# Altium schematic sheet FMC_HPC_UFL_DEBUG_HPC_CD.SchDoc: HPC connector ROW C and ROW D, Testpoints for I2C and JTAG bus signals
size A4; Date: 13.12.2024; ApprovedBy: PFH; CompanyName: IAM Electronic GmbH; DrawnBy: PFH; Engineer: PFH; DocumentNumber: 6; Revision: A; SheetNumber: 6; SheetTotal: 9; Projekt: FMC HPC-U.FL Debug Board; Website: www.fmchub.com
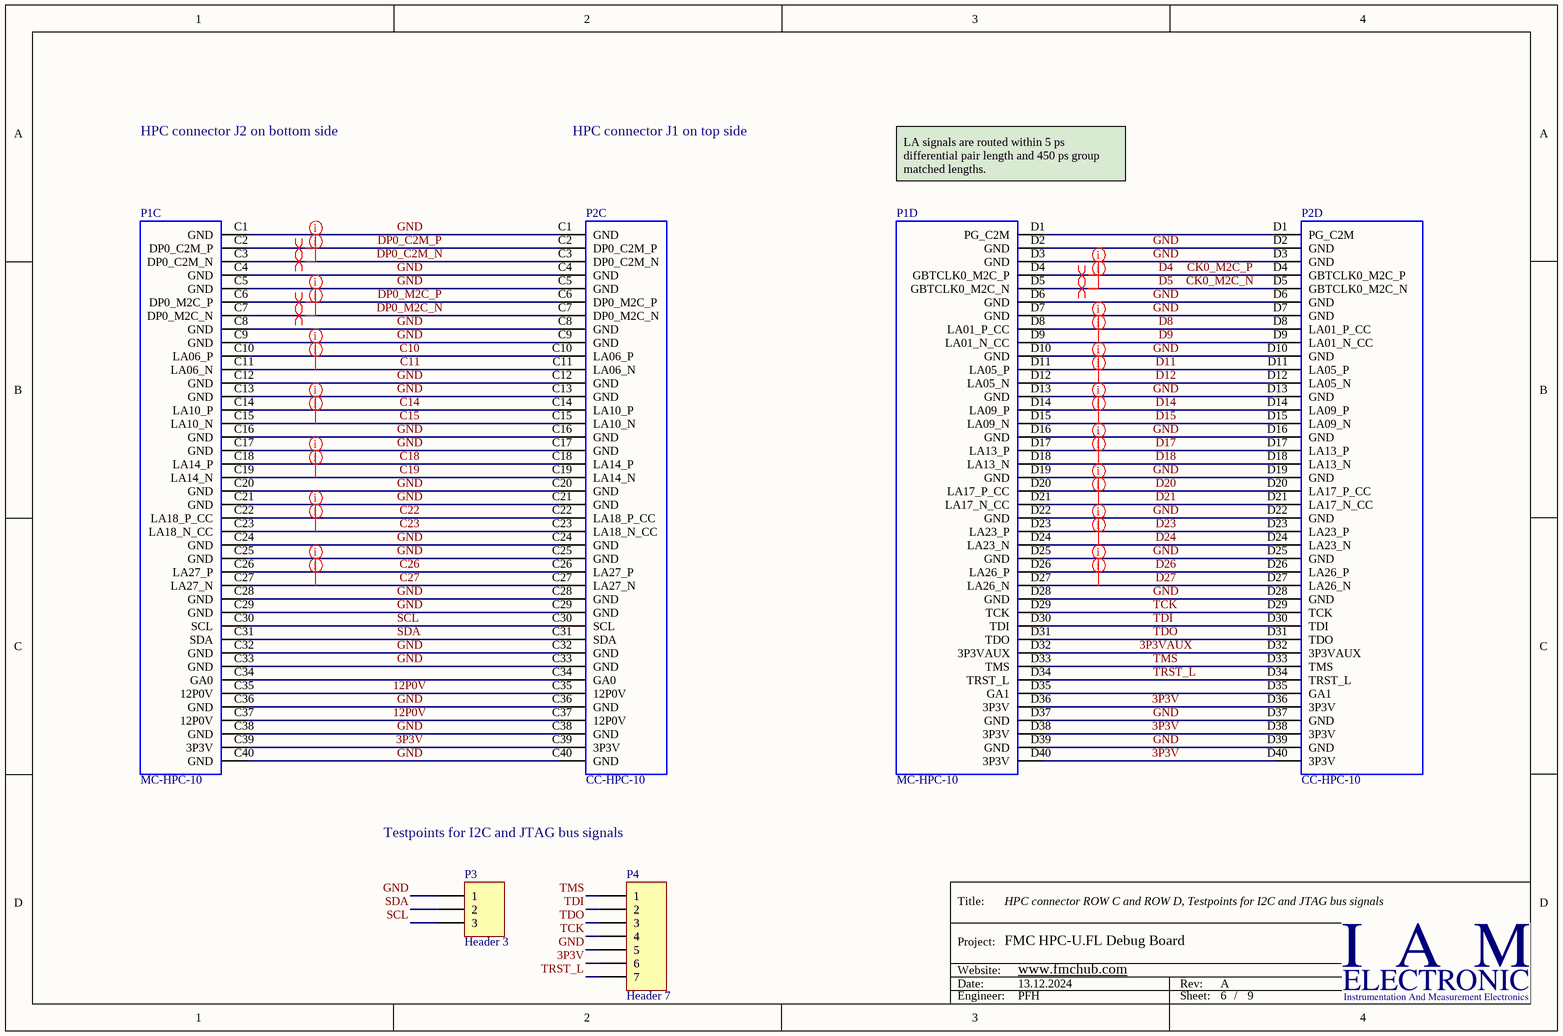
[diagram p0: FMC_HPC_UFL_DEBUG_HPC_CD.SchDoc]

## Parts
P1  MC-HPC-10  [ASP-134488-01]  (parts C,D of 10)
P2  CC-HPC-10  [ASP-134486-01]  (parts C,D of 10)
P3  Header 3  [HDR1X3]  (no BOM)
P4  Header 7  [HDR1X7]  (no BOM)

## Nets
3P3V: P1.C39(3P3V) P1.D36(3P3V) P1.D38(3P3V) P1.D40(3P3V) P2.C39(3P3V) P2.D36(3P3V) P2.D38(3P3V) P2.D40(3P3V) P4.6
3P3VAUX: P1.D32(3P3VAUX) P2.D32(3P3VAUX)
12P0V: P1.C35(12P0V) P1.C37(12P0V) P2.C35(12P0V) P2.C37(12P0V)
C10: P1.C10(LA06_P) P2.C10(LA06_P)
C11: P1.C11(LA06_N) P2.C11(LA06_N)
C14: P1.C14(LA10_P) P2.C14(LA10_P)
C15: P1.C15(LA10_N) P2.C15(LA10_N)
C18: P1.C18(LA14_P) P2.C18(LA14_P)
C19: P1.C19(LA14_N) P2.C19(LA14_N)
C22: P1.C22(LA18_P_CC) P2.C22(LA18_P_CC)
C23: P1.C23(LA18_N_CC) P2.C23(LA18_N_CC)
C26: P1.C26(LA27_P) P2.C26(LA27_P)
C27: P1.C27(LA27_N) P2.C27(LA27_N)
CK0_M2C_N: P1.D5(GBTCLK0_M2C_N) P2.D5(GBTCLK0_M2C_N)  [also labelled D5]
CK0_M2C_P: P1.D4(GBTCLK0_M2C_P) P2.D4(GBTCLK0_M2C_P)  [also labelled D4]
D8: P1.D8(LA01_P_CC) P2.D8(LA01_P_CC)
D9: P1.D9(LA01_N_CC) P2.D9(LA01_N_CC)
D11: P1.D11(LA05_P) P2.D11(LA05_P)
D12: P1.D12(LA05_N) P2.D12(LA05_N)
D14: P1.D14(LA09_P) P2.D14(LA09_P)
D15: P1.D15(LA09_N) P2.D15(LA09_N)
D17: P1.D17(LA13_P) P2.D17(LA13_P)
D18: P1.D18(LA13_N) P2.D18(LA13_N)
D20: P1.D20(LA17_P_CC) P2.D20(LA17_P_CC)
D21: P1.D21(LA17_N_CC) P2.D21(LA17_N_CC)
D23: P1.D23(LA23_P) P2.D23(LA23_P)
D24: P1.D24(LA23_N) P2.D24(LA23_N)
D26: P1.D26(LA26_P) P2.D26(LA26_P)
D27: P1.D27(LA26_N) P2.D27(LA26_N)
DP0_C2M_N: P1.C3(DP0_C2M_N) P2.C3(DP0_C2M_N)
DP0_C2M_P: P1.C2(DP0_C2M_P) P2.C2(DP0_C2M_P)
DP0_M2C_N: P1.C7(DP0_M2C_N) P2.C7(DP0_M2C_N)
DP0_M2C_P: P1.C6(DP0_M2C_P) P2.C6(DP0_M2C_P)
GND: P1.C1(GND) P1.C4(GND) P1.C5(GND) P1.C8(GND) P1.C9(GND) P1.C12(GND) P1.C13(GND) P1.C16(GND) P1.C17(GND) P1.C20(GND) P1.C21(GND) P1.C24(GND) P1.C25(GND) P1.C28(GND) P1.C29(GND) P1.C32(GND) P1.C33(GND) P1.C36(GND) P1.C38(GND) P1.C40(GND) P1.D2(GND) P1.D3(GND) P1.D6(GND) P1.D7(GND) P1.D10(GND) P1.D13(GND) P1.D16(GND) P1.D19(GND) P1.D22(GND) P1.D25(GND) P1.D28(GND) P1.D37(GND) P1.D39(GND) P2.C1(GND) P2.C4(GND) P2.C5(GND) P2.C8(GND) P2.C9(GND) P2.C12(GND) P2.C13(GND) P2.C16(GND) P2.C17(GND) P2.C20(GND) P2.C21(GND) P2.C24(GND) P2.C25(GND) P2.C28(GND) P2.C29(GND) P2.C32(GND) P2.C33(GND) P2.C36(GND) P2.C38(GND) P2.C40(GND) P2.D2(GND) P2.D3(GND) P2.D6(GND) P2.D7(GND) P2.D10(GND) P2.D13(GND) P2.D16(GND) P2.D19(GND) P2.D22(GND) P2.D25(GND) P2.D28(GND) P2.D37(GND) P2.D39(GND) P3.1 P4.5
SCL: P1.C30(SCL) P2.C30(SCL) P3.3
SDA: P1.C31(SDA) P2.C31(SDA) P3.2
TCK: P1.D29(TCK) P2.D29(TCK) P4.4
TDI: P1.D30(TDI) P2.D30(TDI) P4.2
TDO: P1.D31(TDO) P2.D31(TDO) P4.3
TMS: P1.D33(TMS) P2.D33(TMS) P4.1
TRST_L: P1.D34(TRST_L) P2.D34(TRST_L) P4.7
NetP1_C34: P1.C34(GA0) P2.C34(GA0)
NetP1_D1: P1.D1(PG_C2M) P2.D1(PG_C2M)
NetP1_D35: P1.D35(GA1) P2.D35(GA1)

## Layout directives
differential pair: CK0_M2C_N, CK0_M2C_P, DP0_C2M_N, DP0_C2M_P, DP0_M2C_N, DP0_M2C_P
net class MGT; rule Differential Pairs Routing [Pref Gap = 6mil    Min Gap  = 6mil    Max Gap  = 6milPref Width = 6mil    Min Width  = 4mil    Max Width  = 6mil]; rule Matched Net Lengths [Delay Tolerance = 120ps]: CK0_M2C_N, CK0_M2C_P, DP0_C2M_N, DP0_C2M_P, DP0_M2C_N, DP0_M2C_P
rule Width Constraint [Pref Impedance = 50,00ohms    Min Impedance = 50,00ohms    Max Impedance = 50,00ohms]; net class FMC_LA: C10, C11, C14, C15, C18, C19, C22, C23, C26, C27, D8, D9, D11, D12, D14, D15, D17, D18, D20, D21, D23, D24, D26, D27

## Notes on the sheet
- HPC connector J2 on bottom side
- HPC connector J1 on top side
- LA signals are routed within 5 ps differential pair length and 450 ps group matched lengths.
- Testpoints for I2C and JTAG bus signals
- Title:
- Project:
- Date:
- Website:
- Rev:
- Engineer:
- Sheet:
- /

## Library data of the parts
P1 = MC-HPC-10: MC-HPC-10, FMC High-pin count connector, lead free, 400 I/Os, male, 10 mm mated stack height; Manufacturer: Samtec; Manufacturer Ref: SEAM-40-03.5-S-10-2-A-K-TR-VITA57.0; Pitch: 1.27 mm; Mated Stack Height: 10 mm; Solder Type: Lead-Free; Number I/O: 400; PartName: ASP-134488-01; Part: ASP-134488-01; Vita PartNumber: MC-HPC-10; Pin Count: High; Gender: male; Supplier 1: Digi-Key; Supplier Part Number 1: SAM8730-ND
P2 = CC-HPC-10: CC-HPC-10, FMC High-pin count connector, lead free, 400 I/Os, female, 10 mm mated stack height; Manufacturer: Samtec; Manufacturer Ref: SEAF-40-06.5-10-A; Pitch: 1.27 mm; Mated Stack Height: 10 mm; Solder Type: Lead-Free; Number I/O: 400; PartName: ASP-134486-01; Part: ASP-134486-01; Vita PartNumber: CC-HPC-10; Pin Count: High; Gender: female; Supplier 1: Digi-Key; Supplier Part Number 1: SAM8728-ND
P3 = Header 3: Header, 3-Pin; LatestRevisionDate: 17-Jul-2002; LatestRevisionNote: Re-released for DXP Platform.; Publisher: Altium Limited
P4 = Header 7: Header, 7-Pin; LatestRevisionDate: 17-Jul-2002; LatestRevisionNote: Re-released for DXP Platform.; Publisher: Altium Limited